# EasyEDA Pro project ProPrj_transverter-front-end_2026-04-14.epro, schematic transverter-core
Board Name: transverter-core; Create Date: 2026-04-02; Page Name: transverter-core-board; Project Name: transverter-front-end; Schematic Name: transverter-core; Update Date: 2026-04-13; Add into BOM: yes; Company: Your Company; Convert to PCB: yes; Date: 2026-03-10; Draw By: dbenhart; REV: 1.0; Sheet: 1/1; spicePre: .
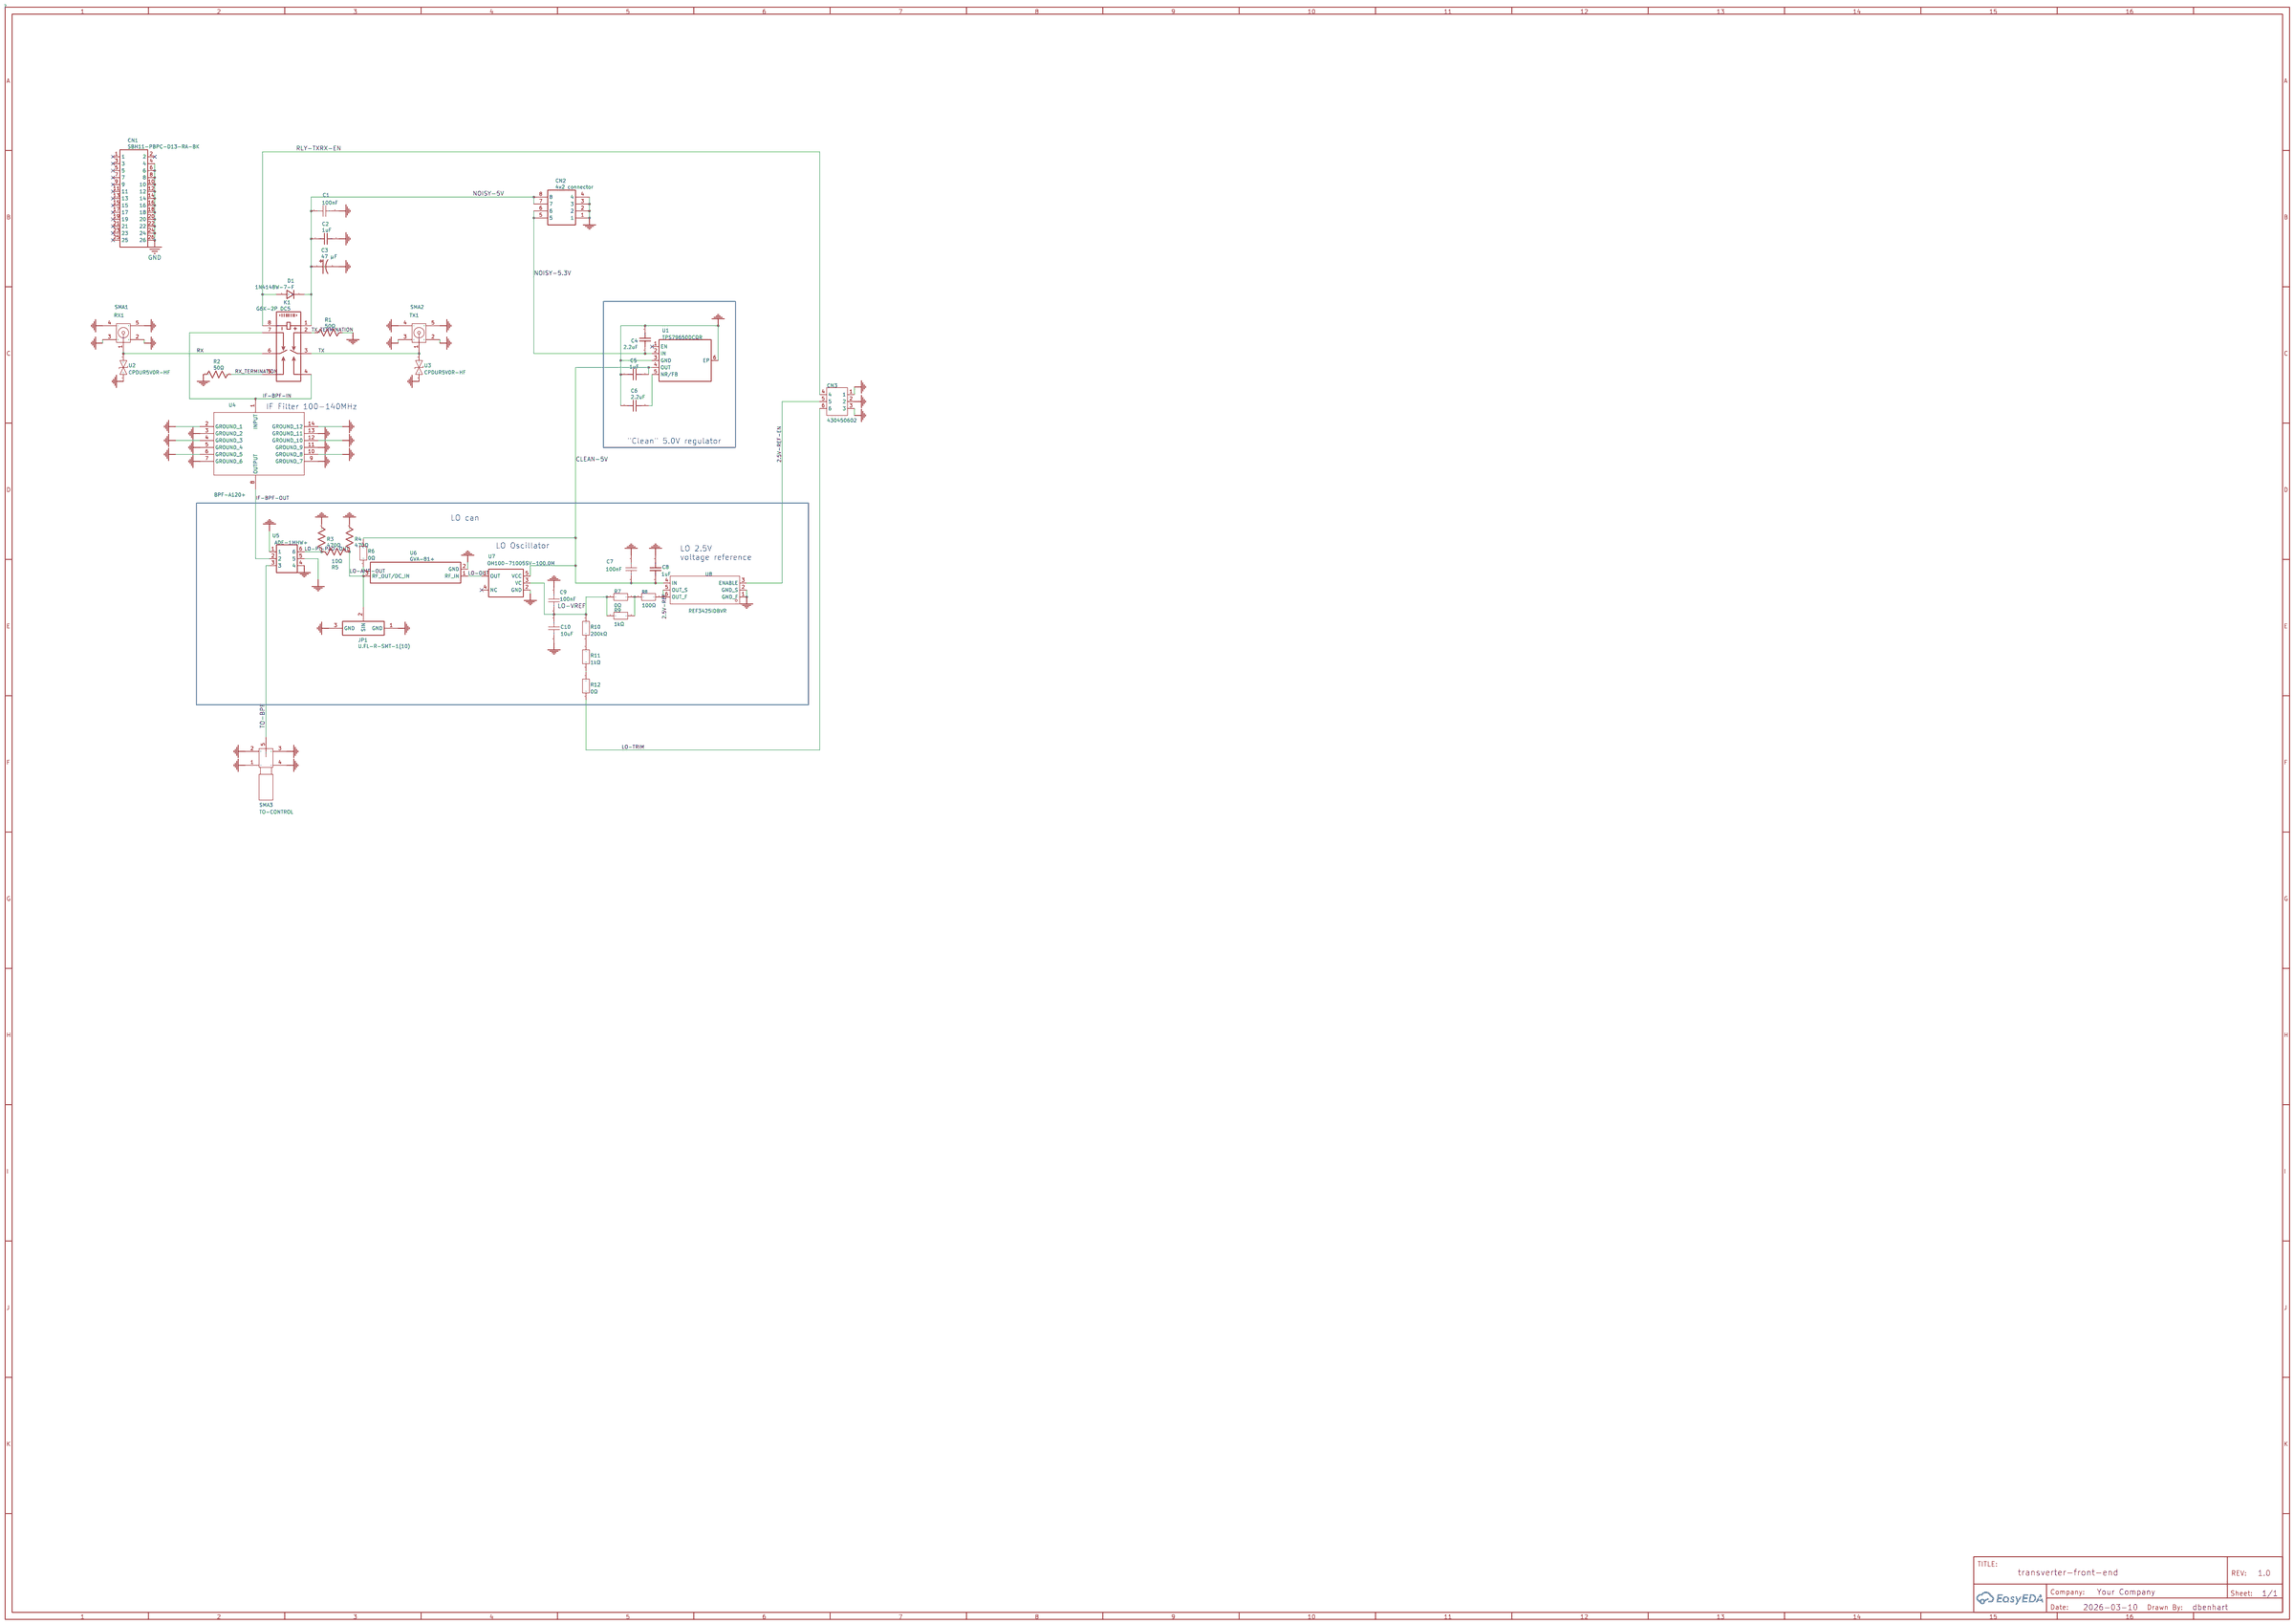
[diagram p2: schematic sheet]

## Parts
C1  100nF  [C0805]
C2  1uF  [C0805]
C3  47 µF  [CAP-TH_BD8.0-P3.50-D0.6-FD]
C4  2.2uF  [C0805]
C5  1uF  [C0805]
C6  2.2uF  [C0805]
C7  100nF  [C0603]
C8  1uF  [C0603]
C9  100nF  [C0603]
C10  10uF  [C0805]
CN1  SBH11-PBPC-D13-RA-BK  [IDC-TH_26P-P2.54-H-M-R2-C13-W8.8]
CN2  4x2 connector  [CONN-TH_0430450800]
CN3  430450602  [CONN-TH_6P-P3.00_43045-0600]
D1  1N4148W-7-F  [SOD-123_L2.7-W1.6-LS3.7-RD-1]
JP1  U.FL-R-SMT-1(10)  [ANT-SMD_UFL-R-SMT-1-10]
K1  G6K-2P DC5  [RELAY-TH_G6K-2P]
R1  50Ω  [R1206]
R2  50Ω  [R1206]
R3  470Ω  [R0603_NEW]
R4  470Ω  [R0603_NEW]
R5  10Ω  [R0603_NEW]
R6  0Ω  [R0603_NEW]
R7  0Ω  [R0603_NEW]
R8  100Ω  [R0603]
R9  1kΩ  [R0603_NEW]
R10  200kΩ  [R0603]
R11  1kΩ  [R0603_NEW]
R12  0Ω  [R0603_NEW]
SMA1  RX1  [SMA-TH_CONSMA002-L-G]
SMA2  TX1  [SMA-TH_CONSMA002-L-G]
SMA3  TO-CONTROL  [ANT-TH_SMA-J-P-H-RA-TH1]
U1  TPS79650DCQR  [SOT-223-6_L6.5-W3.5-P1.27-LS7.0-BR]
U2  CPDUR5V0R-HF  [SOD-523F_L1.7-W1.0-BI]
U3  CPDUR5V0R-HF  [SOD-523F_L1.7-W1.0-BI]
U4  BPF-A120+  [FILTER-SMD_14P-L34.5-W9.3_BPF-A950]
U5  ADE-1MHW+  [XFMR-SMD_L7.9-W5.6-P2.54_ADTT1-6]
U6  GVA-81+  [SOT-89-3_L4.5-W2.4-P1.50-LS4.0-BR]
U7  OH100-71005SV-100.0M  [OSC-TH_5P-L25.4-W25.4-P9.50-TL]
U8  REF3425IDBVR  [SOT-23-6_L2.9-W1.6-P0.95-LS2.8-BR]

## Library data of the parts
C1 = KGM21NR71E104KT: Capacitance:100nF Tolerance:±10% Tolerance:±10% Voltage Rating:25V Temperature Coefficient:X7R; LCSC Part Name: 100nF ±10% 25V; Supplier Part: C20220997; Manufacturer: Kyocera AVX; Manufacturer Part: KGM15ACG1H102JT; JLCPCB Part Class: Extended Part; Supplier: LCSC; Tolerance: ±10%; Voltage Rating: 25V; Temperature Coefficient: X7R; Check: false
C2 C5 = 1uF: Supplier Part: 478-KGM21ER71E105KUCT-ND; Supplier: Digi-Key; Manufacturer Part: KGM21ER71E105KU; voltage: 25; Manufacturer: KYOCERA AVX; nameAlias: Value(F); Contributor: LCEDA_Lib; spicePre: C; spiceSymbolName: C_0603_US; Package Display: No; Check: false
C3 = EEH-AZA1H470B: Supplier: Digi-Key; Supplier Part: 10-EEH-AZA1H470BCT-ND; Manufacturer: PANASONIC(松下); JLCPCB Part Class: Extended Part; Contributor: lcsc; spicePre: C; spiceSymbolName: EEH-AZA1H680B; Check: false
C4 C6 = 2.2uF: Supplier: LCSC; Supplier Part: C723892; Manufacturer: muRata(村田); Manufacturer Part: GRT21BR71E225KE13L; JLCPCB Part Class: Extended Part; nameAlias: Value; Contributor: LCSC; spicePre: C; spiceSymbolName: GRT21BR71E225KE13L; Check: false
C7 C9 = KGM15BR71H104KT: Capacitance:100nF Tolerance:±10% Tolerance:±10% Voltage Rating:50V Temperature Coefficient:X7R; LCSC Part Name: 100nF ±10% 50V; Supplier Part: C18522987; Manufacturer: Kyocera AVX; Supplier Footprint: 0603; JLCPCB Part Class: Extended Part; Supplier: LCSC; Tolerance: ±10%; Voltage Rating: 50V; Temperature Coefficient: X7R; Check: false
C8 = 1uF: Supplier Part: 478-KGM21ER71E105KUCT-ND; Supplier: Digi-Key; Manufacturer Part: KGM15ACG1H102JT; voltage: 25; Manufacturer: KYOCERA AVX; nameAlias: Value(F); Contributor: LCEDA_Lib; spicePre: C; spiceSymbolName: C_0603_US; Package Display: No; Check: false
C10 = GRM21BZ71E106KE15L: Capacitance: Tolerance:±10% Tolerance:±10% Voltage Rating: Temperature Coefficient:; LCSC Part Name: 10uF ±10% 25V; Supplier Part: C237493; Manufacturer: muRata(村田); Supplier Footprint: 0805; JLCPCB Part Class: Extended Part; Datasheet: https://atta.szlcsc.com/upload/public/pdf/source/20200305/C490387_23319AE8C154DEB24C505E6C82A8106A.pdf; Supplier: LCSC; Tolerance: ±10%; Check: false
CN1 = SBH11-PBPC-D13-RA-BK: Supplier: LCSC; Supplier Part: C17260960; Manufacturer: Sullins; JLCPCB Part Class: Extended Part; Contributor: lcsc; spicePre: C
CN2 = 0430450800: Supplier: LCSC; Manufacturer: MOLEX; Supplier Part: C122422; JLCPCB Part Class: Extended Part; spicePre: C; Check: false
CN3 = 430450602: Pins Structure:2x3P Pitch:3mm Mounting Type:Right-Angle Reference Series:Micro-Fit(MX 3.0) Number of Pins:6P Number of Rows:2 Number of PINs Per Row:3 Row Spacing:3mm Current Rating:8.5A Contact Material:Brass Contact Plating:Gold Operating Temperature:-4; LCSC Part Name: 2x3P 间距:3mm 弯插 系列:Micro-Fit(MX 3.0); Supplier Part: C587577; Manufacturer: MOLEX; JLCPCB Part Class: Extended Part; Datasheet: https://www.molex.com/content/dam/molex/molex-dot-com/products/automated/en-us/salesdrawingpdf/430/43045/430450602_sd.pdf?inline\; Supplier: LCSC; Pins Structure: 2x3P; Pitch: 3mm; Mounting Type: Right-Angle; Reference Series: Micro-Fit(MX 3.0); Number of Pins: 6P; Number of Rows: 2; Number of PINs Per Row: 3; Row Spacing: 3mm; Current Rating: 8.5A; Contact Material: Brass; Contact Plating: Gold; Operating Temperature: -40℃~+105℃; Voltage Rating: 600V; Flame Retardant Rating: UL94V-0; Supplementary Features: Fishhook Foot (Plastic); Color: Black; Z-Height of the Board: 8.77mm; X-Length of Bottom Edge on Board (Spacing Line): 12.65mm; Y-Width of Bottom Edge on Board: 12.24mm; Check: false
D1 = 1N4148W-7-F: Supplier: LCSC; Manufacturer: DIODES(美台); Supplier Part: C83528; JLCPCB Part Class: Extended Part; spicePre: D; Check: false
JP1 = U.FL-R-SMT-1(10): Supplier: LCSC; Manufacturer: HRS(广濑); Supplier Part: C88373; JLCPCB Part Class: Extended Part; spicePre: J; Check: false
K1 = G6K-2P DC5: Supplier: LCSC; Supplier Part: C397137; Manufacturer: OMRON(欧姆龙); JLCPCB Part Class: Extended Part; Contributor: LCSC; spicePre: K; Check: false
R1 R2 = 50Ω: Manufacturer Part: TNPW120650R0BEEN; Manufacturer: Vishay Dale; nameAlias: Value(Ω); Contributor: LCEDA_Lib; spicePre: R; spiceSymbolName: R_0603_US; Package Display: No; Check: false
R3 = 470Ω: Manufacturer Part: TNPW0603470RBYEN; Manufacturer: Vishay Dale; nameAlias: Value(Ω); Contributor: LCEDA_Lib; spicePre: R; spiceSymbolName: R_0603_US; Package Display: No; Check: false
R4 = 470Ω: Manufacturer Part: TNPW0603470RBEEA; Manufacturer: Vishay Dale; nameAlias: Value(Ω); Contributor: LCEDA_Lib; spicePre: R; spiceSymbolName: R_0603_US; Package Display: No; Check: false
R5 = 10Ω: Manufacturer Part: TNPW060310R0BEEA; Manufacturer: Vishay Dale; nameAlias: Value(Ω); Contributor: LCEDA_Lib; spicePre: R; spiceSymbolName: R_0603_US; Package Display: No; Check: false
R6 R7 R12 = CRCW06030000Z0EA: Type:Thick Film Resistors Resistance: Tolerance:- Tolerance:- Power(Watts): Overload Voltage (Max): Temperature Coefficient:- Temperature Coefficient:- Operating Temperature Range:-55℃~+155℃ Operating Temperature Range:-55℃~+155℃; LCSC Part Name: 厚膜电阻 0Ω 100mW; Supplier Part: C844915; Manufacturer: VISHAY(威世); Supplier Footprint: 0603; JLCPCB Part Class: Extended Part; Datasheet: https://atta.szlcsc.com/upload/public/pdf/source/20200927/C844919_23E7F5DF28E9421F105631C5C2D28736.pdf; Supplier: LCSC; Type: Thick Film Resistors; Operating Temperature Range: -55℃~+155℃
R8 = TNPW0603100RBEEA: Type:Thin Film Resistor Resistance:100Ω Tolerance:±0.1% Tolerance:±0.1% Power(Watts):100mW Temperature Coefficient:±25ppm/℃ Temperature Coefficient:±25ppm/℃ Operating Temperature:-55℃~+155℃ Operating Temperature:-55℃~+155℃; LCSC Part Name: 薄膜电阻 100Ω ±0.1% 100mW; Supplier Part: C844889; Manufacturer: VISHAY(威世); Supplier Footprint: 0603; JLCPCB Part Class: Extended Part; Datasheet: https://item.szlcsc.com/datasheet/TNPW0603100RBEEA/904463.html; Supplier: LCSC; Type: Thin Film Resistor; Tolerance: ±0.1%; Power(Watts): 100mW; Temperature Coefficient: ±25ppm/℃; Operating Temperature: -55℃~+155℃
R9 R11 = TNPW06031K00BEEA: Type:Thin Film Resistor Resistance:1kΩ Tolerance:±0.1% Tolerance:±0.1% Power(Watts):210mW Voltage-Supply(Max):75V Temperature Coefficient:±25ppm/℃ Temperature Coefficient:±25ppm/℃ Operating Temperature:-55℃~+155℃ Operating Temperature:-55℃~+155℃; LCSC Part Name: 薄膜电阻 1kΩ ±0.1% 210mW; Supplier Part: C844891; Manufacturer: VISHAY(威世); Supplier Footprint: 0603; JLCPCB Part Class: Extended Part; Datasheet: https://item.szlcsc.com/datasheet/TNPW06031K00BEEA/904465.html; Supplier: LCSC; Type: Thin Film Resistor; Tolerance: ±0.1%; Power(Watts): 210mW; Voltage-Supply(Max): 75V; Temperature Coefficient: ±25ppm/℃; Operating Temperature: -55℃~+155℃
R10 = TNPW0603200KBEEA: Type:Thin Film Resistor Resistance:200kΩ Tolerance:±0.1% Tolerance:±0.1% Power(Watts):125mW Temperature Coefficient:±25ppm/℃ Temperature Coefficient:±25ppm/℃ Operating Temperature:-55℃~+155℃ Operating Temperature:-55℃~+155℃; LCSC Part Name: 薄膜电阻 200kΩ ±0.1% 125mW; Supplier Part: C844456; Manufacturer: VISHAY(威世); Supplier Footprint: 0603; JLCPCB Part Class: Extended Part; Datasheet: https://item.szlcsc.com/datasheet/TNPW0603200KBEEA/904030.html; Supplier: LCSC; Type: Thin Film Resistor; Tolerance: ±0.1%; Power(Watts): 125mW; Temperature Coefficient: ±25ppm/℃; Operating Temperature: -55℃~+155℃
SMA1 SMA2 = CONSMA002-L-G_C22417819: Connector Type:Board Side Interface:Inner Bore Number of Ports:1 Frequency:18GHz RF Series:SMA Impedance:50Ω Style:Elbow Operating Temperature Range:-65℃~+165℃ Operating Temperature Range:-65℃~+165℃; LCSC Part Name: 内孔 SMA 弯头; Supplier Part: C22417819; Manufacturer: TE Connectivity(泰科电子); Manufacturer Part: CONSMA002-L-G; Supplier Footprint: 弯插; JLCPCB Part Class: Extended Part; Datasheet: https://item.szlcsc.com/datasheet/CONSMA002-L-G/24041456.html; Supplier: LCSC; Connector Type: Board Side; Interface: Inner Bore; Number of Ports: 1; RF Series: SMA; Impedance: 50Ω; Style: Elbow; Operating Temperature Range: -65℃~+165℃; Check: false
SMA3 = SMA-J-P-H-RA-TH1_C6488932: Connector Type:Board Side Number of Ports:1 Frequency:20GHz RF Series:SMA Impedance:50Ω Rated Voltage (Max):335V Operating Temperature Range:-65℃~+125℃ Operating Temperature Range:-65℃~+125℃; LCSC Part Name: SMA; Supplier Part: C6488932; Manufacturer: SAMTEC; Manufacturer Part: SMA-J-P-H-RA-TH1; Supplier Footprint: 插件; JLCPCB Part Class: Extended Part; Datasheet: https://item.szlcsc.com/datasheet/SMA-J-P-H-RA-TH1/7442116.html; Supplier: LCSC; Connector Type: Board Side; Number of Ports: 1; RF Series: SMA; Impedance: 50Ω; Rated Voltage (Max): 335V; Operating Temperature Range: -65℃~+125℃; Check: false
U1 = TPS79650DCQR: Supplier: LCSC; Supplier Part: C2860666; Manufacturer: TI(德州仪器); JLCPCB Part Class: Extended Part; Contributor: LCSC; spicePre: U; Check: false
U2 U3 = CPDUR5V0R-HF: Reverse Stand-Off Voltage (Vrwm):5V Maximum Clamping Voltage:13V Peak Pulse Current (Ipp):12A@8/20us Peak Pulse Power Dissipation (Ppp):- Breakdown Voltage:5.6V Type:TVS; LCSC Part Name: TVS 5V截止 12A峰值脉冲; Supplier Part: C2443353; Manufacturer: Comchip(典琦); Supplier Footprint: SOD-523F(0603); JLCPCB Part Class: Extended Part; Datasheet: https://atta.szlcsc.com/upload/public/pdf/source/20240124/4F967C0056EC9CD23683E7FA15AA3325.pdf; Supplier: LCSC; Reverse Stand-Off Voltage (Vrwm): 5V; Maximum Clamping Voltage: 20V; Peak Pulse Current (Ipp): 3A@10/1000us; Breakdown Voltage: 6V; Type: TVS
U4 = BPF-A120+: Bandwidth:40MHz Filter Type:带通 Insertion Loss:2.5dB; Supplier Part: C3155257; Manufacturer: Mini-Circuits; Supplier Footprint: SMD-14P,34.5x9.3mm; JLCPCB Part Class: Extended Part; Supplier: LCSC; Bandwidth: 40MHz; Filter Type: 带通; Insertion Loss: 2.5dB; Check: false
U5 = ADE-1MHW+: Supplier: LCSC; Supplier Part: C5939982; Manufacturer: Mini-Circuits; JLCPCB Part Class: Extended Part; Contributor: lcsc; spicePre: U; Check: false
U6 = GVA-81+: Supplier: LCSC; Supplier Part: C6050607; Manufacturer: Mini-Circuits; JLCPCB Part Class: Extended Part; Contributor: lcsc; spicePre: U; Check: false
U7 = OH100-71005SV-100.0M: Supplier: Digi-Key; Supplier Part: CW912-ND; Manufacturer: Connor-Winfield; Contributor: lcsc; spicePre: U; spiceSymbolName: OH100-71003SV-010.0M; Package Display: No; Check: false
U8 = REF3425IDBVR: Output Type:Fixed Voltage - Supply:2.55V~12V Voltage - Supply:2.55V~12V Output Voltage:2.5V Output Voltage:2.5V Output Current:10mA Tolerance:±0.05% Tolerance:±0.05% Temperature Coefficient:6ppm/℃ Reference Type:Series Quiescent Current:95uA Minimum Catho; LCSC Part Name: 2.55V~12V 串联 95uA 6ppm/℃; Supplier Part: C187836; Manufacturer: TI(德州仪器); Supplier Footprint: SOT-23-6; JLCPCB Part Class: Extended Part; Datasheet: https://www.ti.com/cn/lit/gpn/ref3425; Supplier: LCSC; Output Type: Fixed; Voltage - Supply: 2.55V~12V; Output Voltage: 2.5V; Output Current: 10mA; Tolerance: ±0.05%; Temperature Coefficient: 6ppm/℃; Reference Type: Series; Quiescent Current: 95uA; Noise - 10Hz to 10kHz: 24uVrms; Operating Temperature: -40℃~+125℃; Check: false

## Nets
2.5V-REF: R8.2 U8.5(OUT_S) U8.6(OUT_F)
2.5V-REF-EN: CN3.5 U8.3(ENABLE)
GND: C1.2 C2.2 C3.2 C4.2 C5.1 C6.1 C7.1 C8.2 C9.1 C10.2 CN1.4 CN1.6 CN1.8 CN1.10 CN1.12 CN1.14 CN1.16 CN1.18 CN1.20 CN1.22 CN1.24 CN1.26 CN2.1 CN2.2 CN2.3 CN2.4 CN3.1 CN3.2 CN3.3 JP1.1(GND) JP1.3(GND) R1.2 R2.1 R3.1 R4.1 SMA1.2 SMA1.3 SMA1.4 SMA1.5 SMA2.2 SMA2.3 SMA2.4 SMA2.5 SMA3.1 SMA3.2 SMA3.3 SMA3.4 U1.3(GND) U1.6(EP) U2.1 U3.1 U4.2(GROUND_1) U4.3(GROUND_2) U4.4(GROUND_3) U4.5(GROUND_4) U4.6(GROUND_5) U4.7(GROUND_6) U4.9(GROUND_7) U4.10(GROUND_8) U4.11(GROUND_9) U4.12(GROUND_10) U4.13(GROUND_11) U4.14(GROUND_12) U5.1 U5.4 U5.5 U6.2(GND) U7.2(GND) U8.1(GND_F) U8.2(GND_S)
CLEAN-5V: C5.2 C7.2 C8.1 R6.1 U1.4(OUT) U7.5(VCC) U8.4(IN)
IF-BPF-IN: K1.4 K1.7 U4.1(INPUT)
IF-BPF-OUT: U4.8(OUTPUT) U5.2
LO-AMP-OUT: JP1.2(SIN) R4.2 R5.2 R6.2 U6.3(RF_OUT/DC_IN)
LO-OUT: U6.1(RF_IN) U7.1(OUT)
LO-PI-PAD-OUT: R3.2 R5.1 U5.6
LO-TRIM: CN3.6 R12.2
LO-VREF: C9.2 C10.1 R7.1 R9.1 R10.1 U7.3(VC)
NOISY-5.3V: C4.1 CN2.5 CN2.6 U1.2(IN)
NOISY-5V: C1.1 C2.1 C3.1 CN2.7 CN2.8 D1.1(C) K1.1
RLY-TXRX-EN: CN3.4 D1.2(A) K1.8
RX: K1.6 SMA1.1 U2.2
RX_TERMINATION: K1.5 R2.2
TO-BPF: SMA3.5 U5.3
TX: K1.3 SMA2.1 U3.2
TX_TERMINATION: K1.2 R1.1
$C6_2: C6.2 U1.5(NR/FB)
$R7_2: R7.2 R8.1 R9.2
$R10_2: R10.2 R11.1
$R11_2: R11.2 R12.1

Not connected (* = marked no-connect by the designer): CN1 1* 2* 3* 5* 7* 9* 11* 13* 15* 17* 19* 21* 23* 25*; U1 1(EN)*; U7 4(NC)*

## Notes on the sheet
- IF Filter 100-140MHz
- "Clean" 5.0V regulator
- LO can
- LO Oscillator
- LO 2.5V
  voltage reference
